# EasyEDA Pro project ProPrj_AI台灯_模块版_2026-09-22.epro, schematic Schematic1, sheets 1 to 4 of 5

## Sheets
1 POWER: Assembly Variant: Basic; Board Name: Board1; Create Date: 2026-09-16; Page Name: P1; Project Name: AI台灯_模块版; Schematic Name: Schematic1; Update Date: 2026-09-16; Company: 嘉立创EDA; Page Size: A4; Version: V1.0
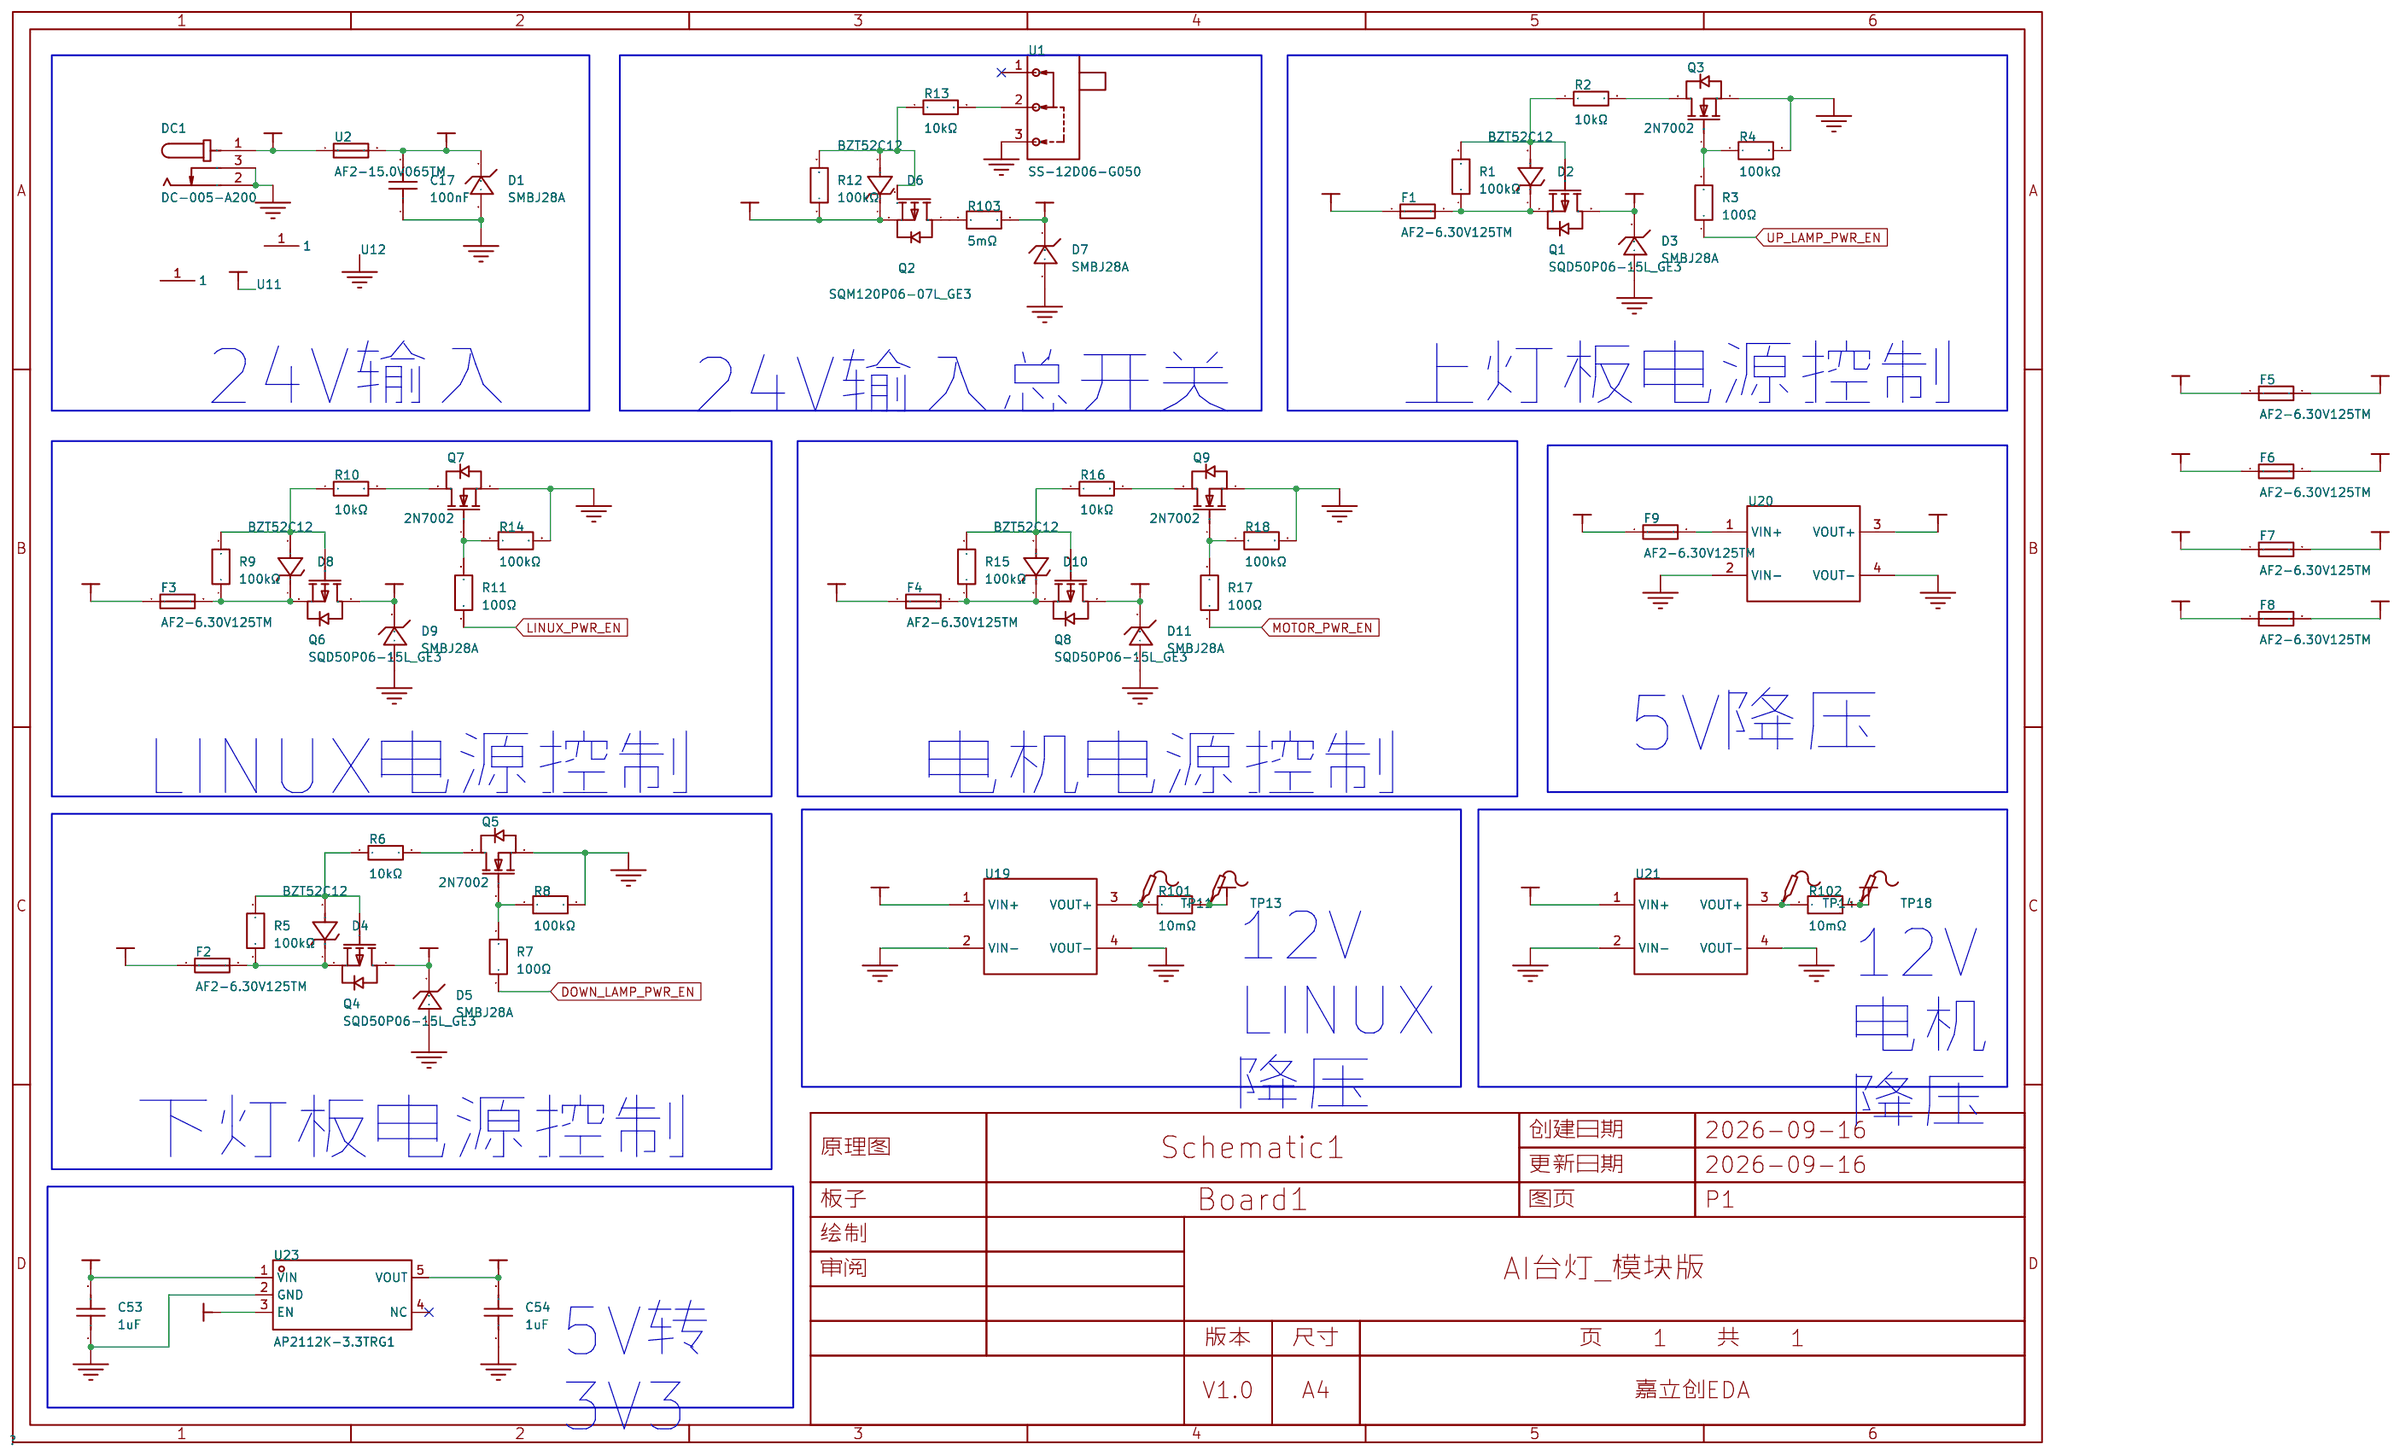
[diagram p0: POWER]
2 MCU_CORE: Page Name: P3
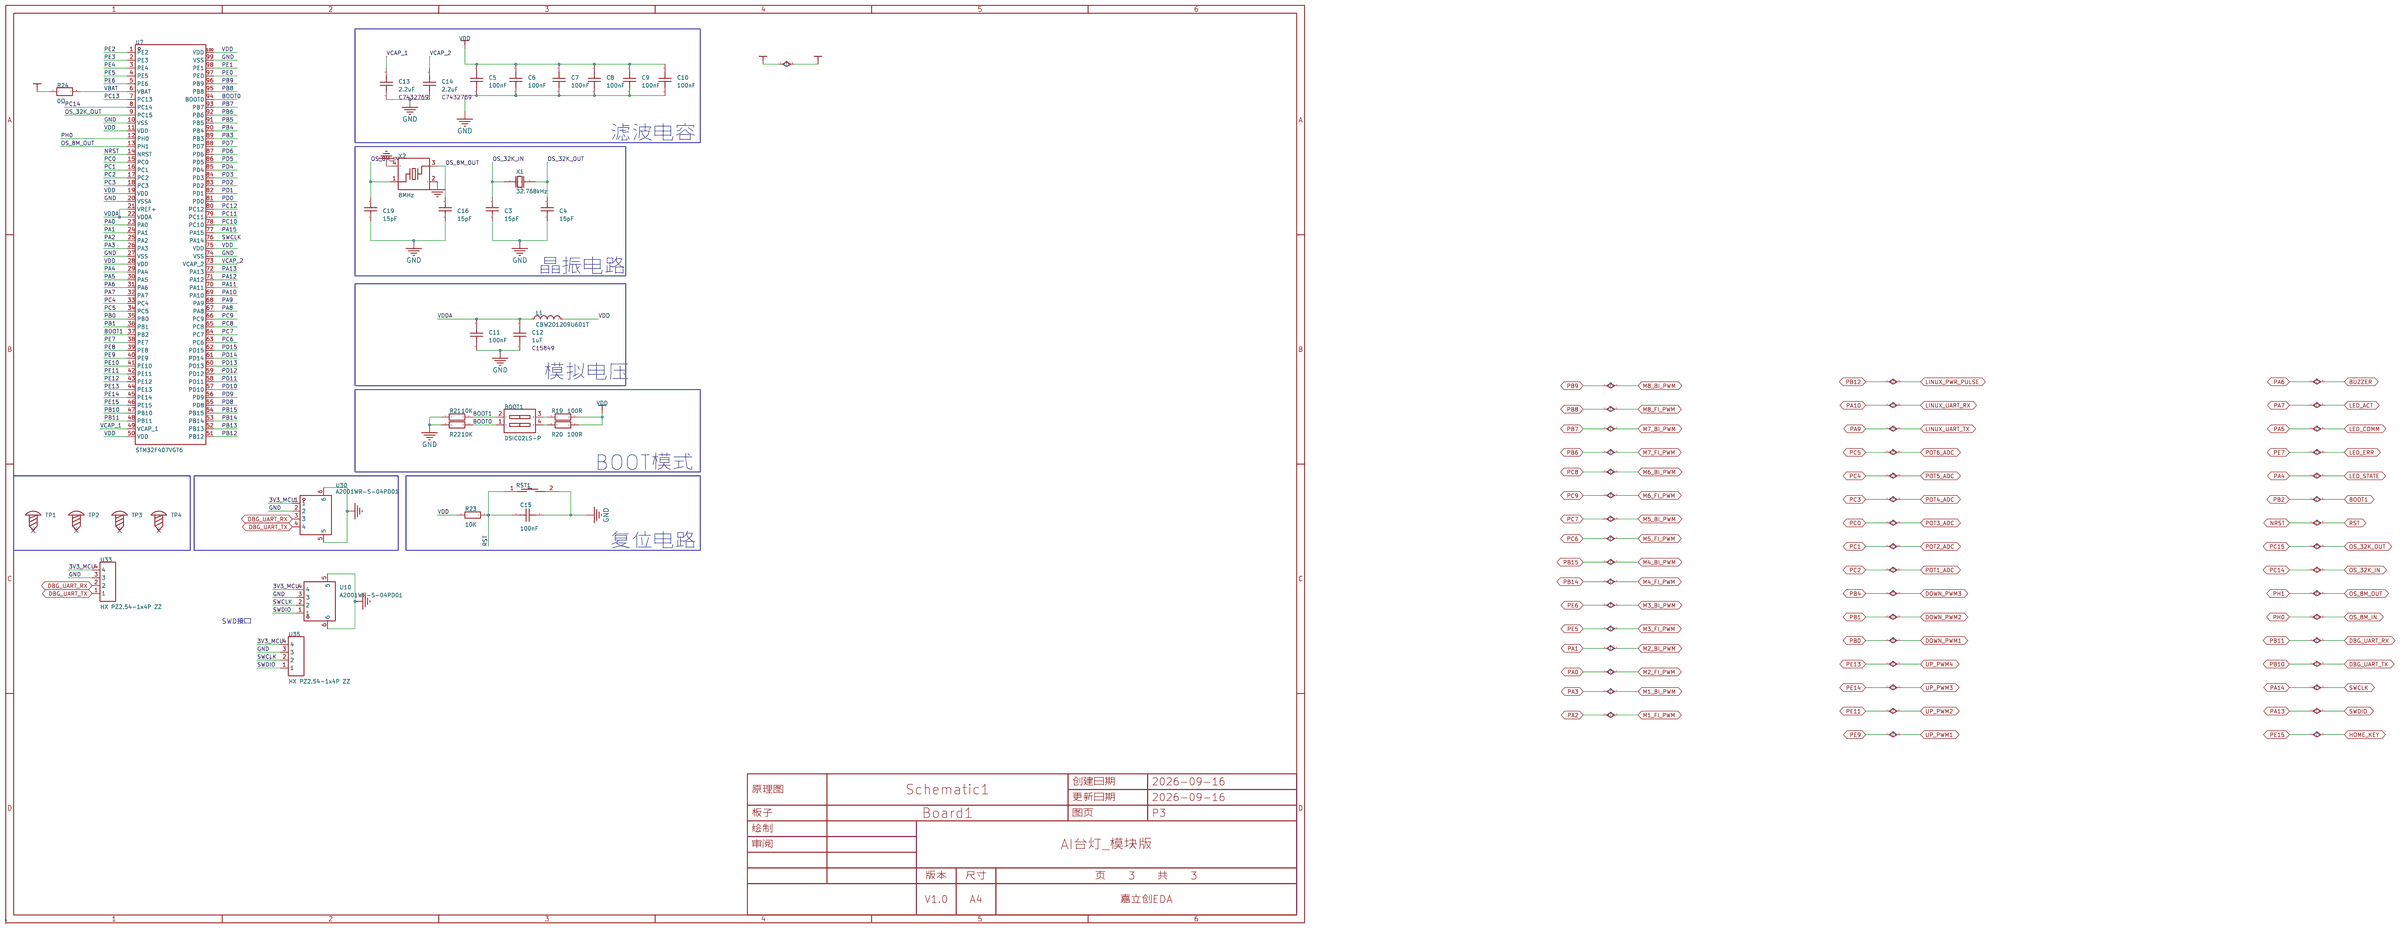
[diagram p1: MCU_CORE]
3 MOTOR_DRIVER: Page Name: P4
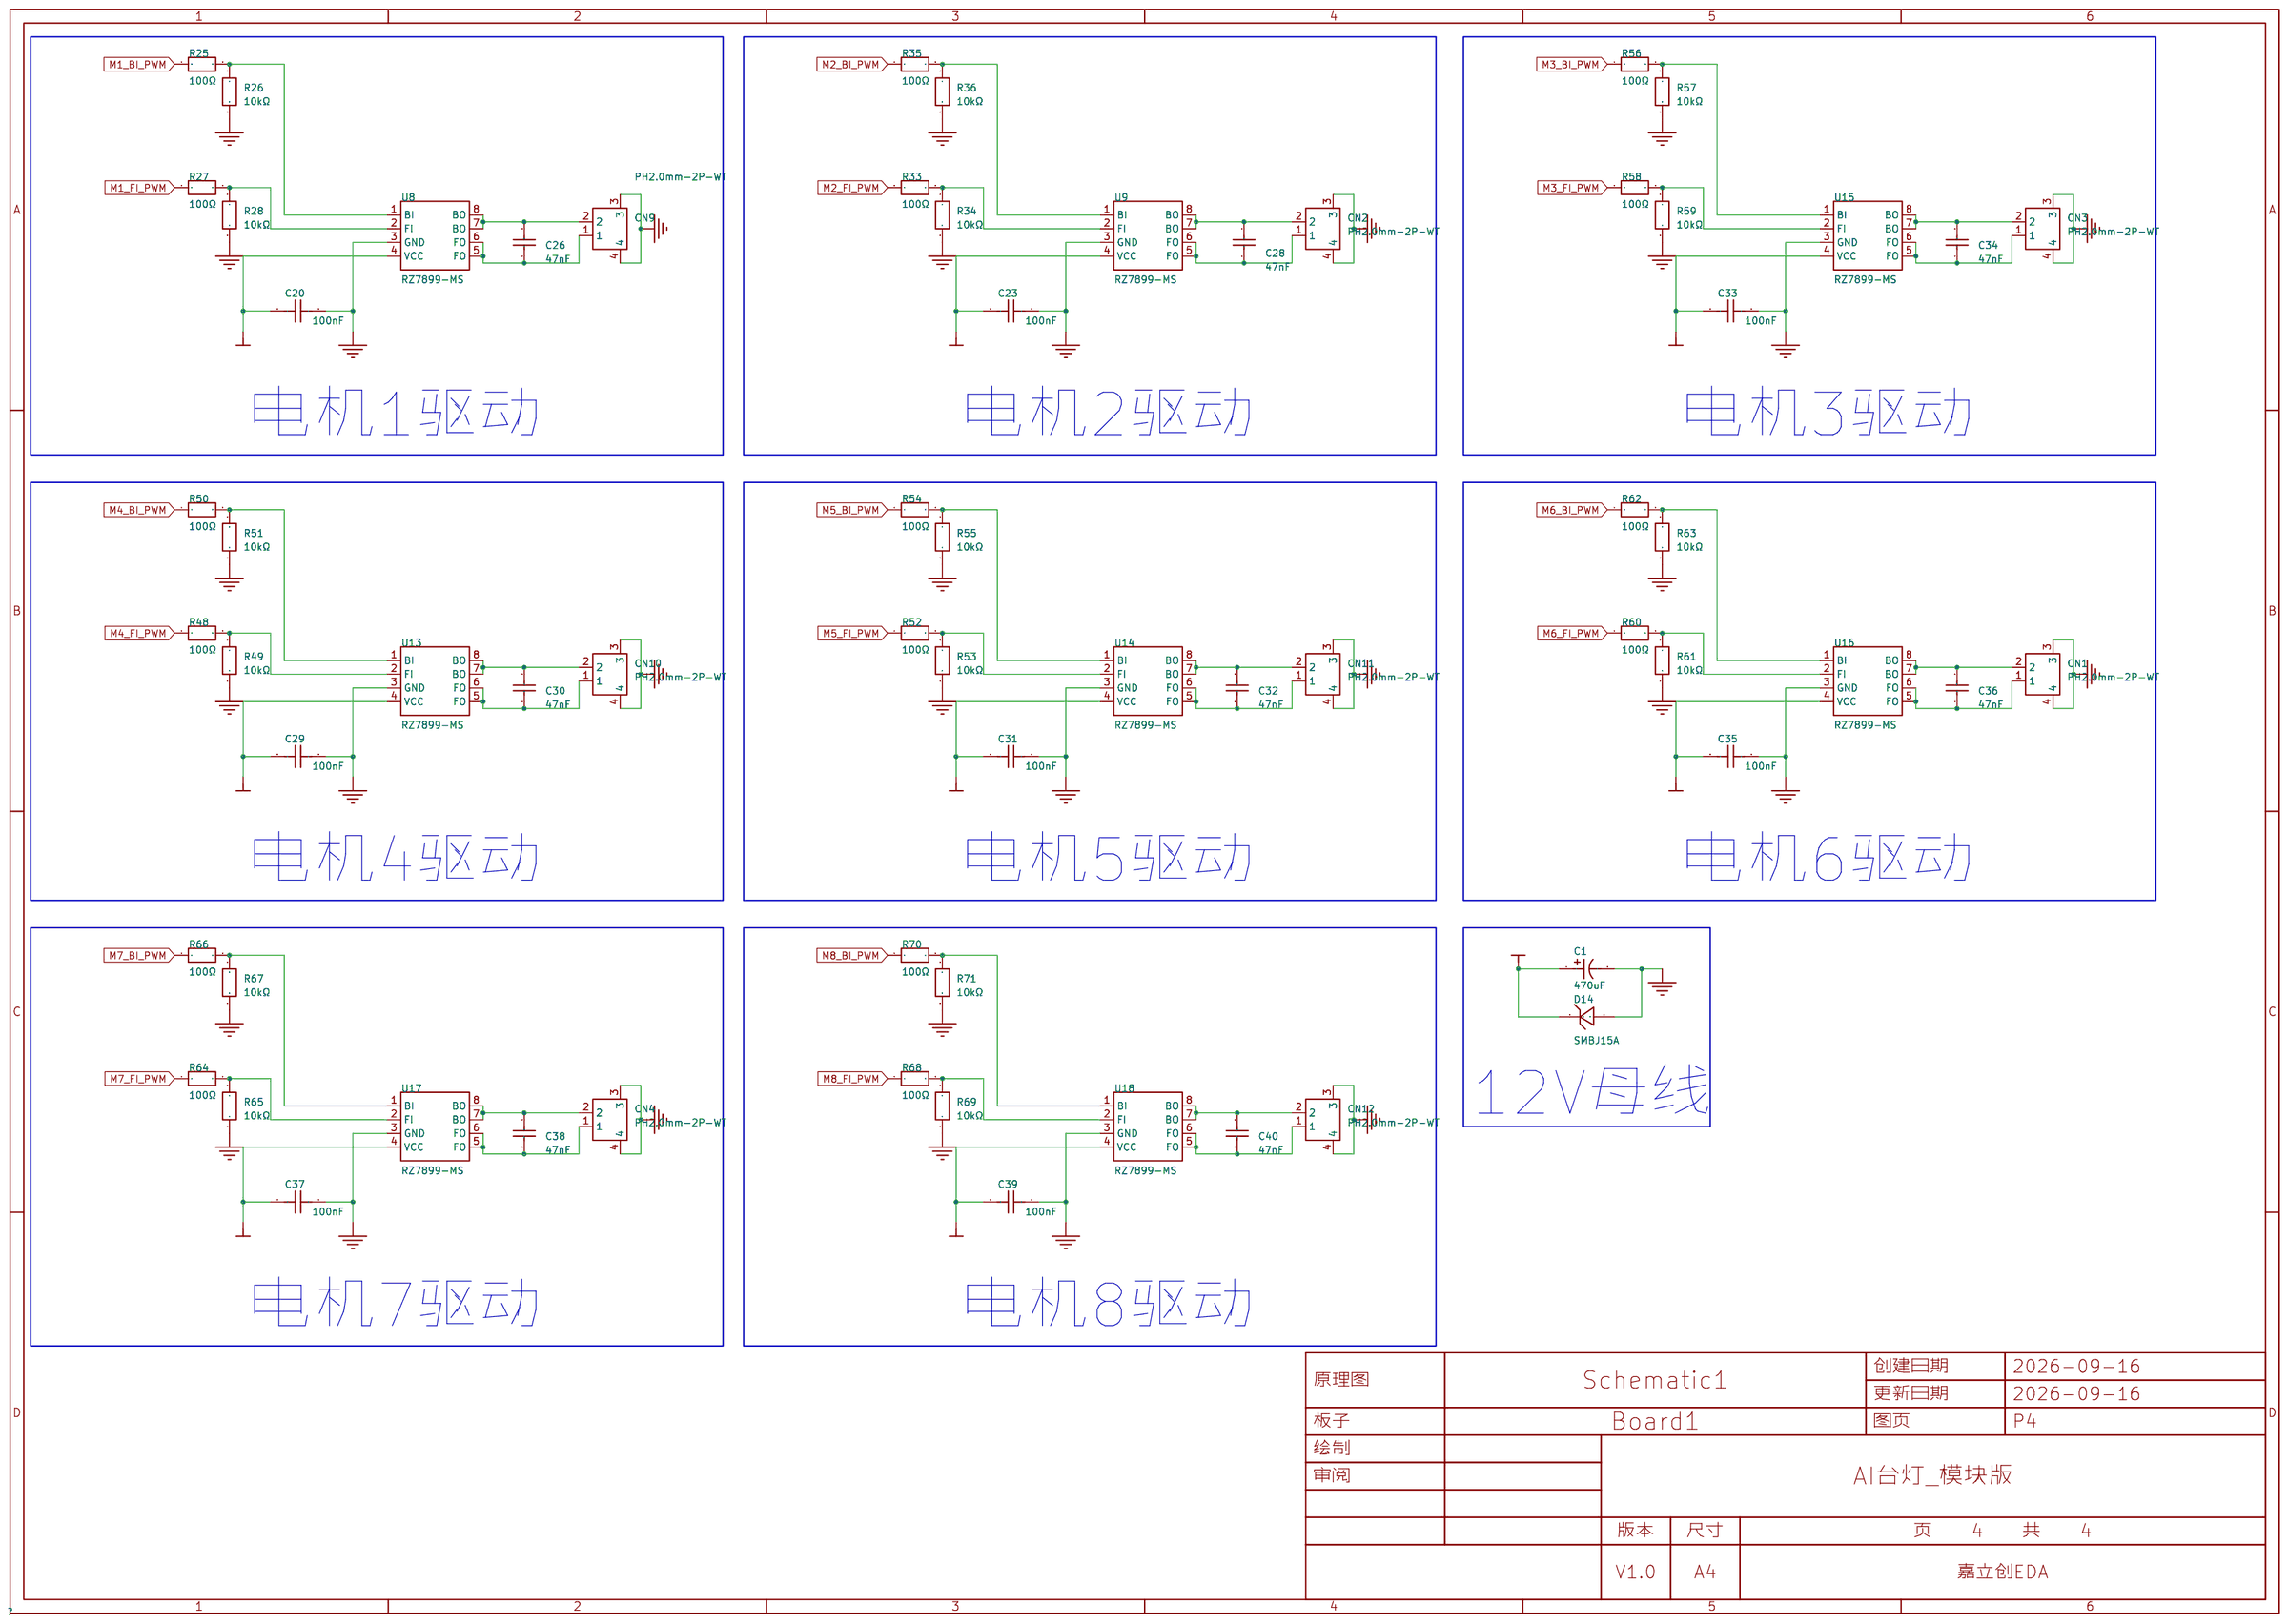
[diagram p2: MOTOR_DRIVER]
4 POT_ADC: Page Name: P5
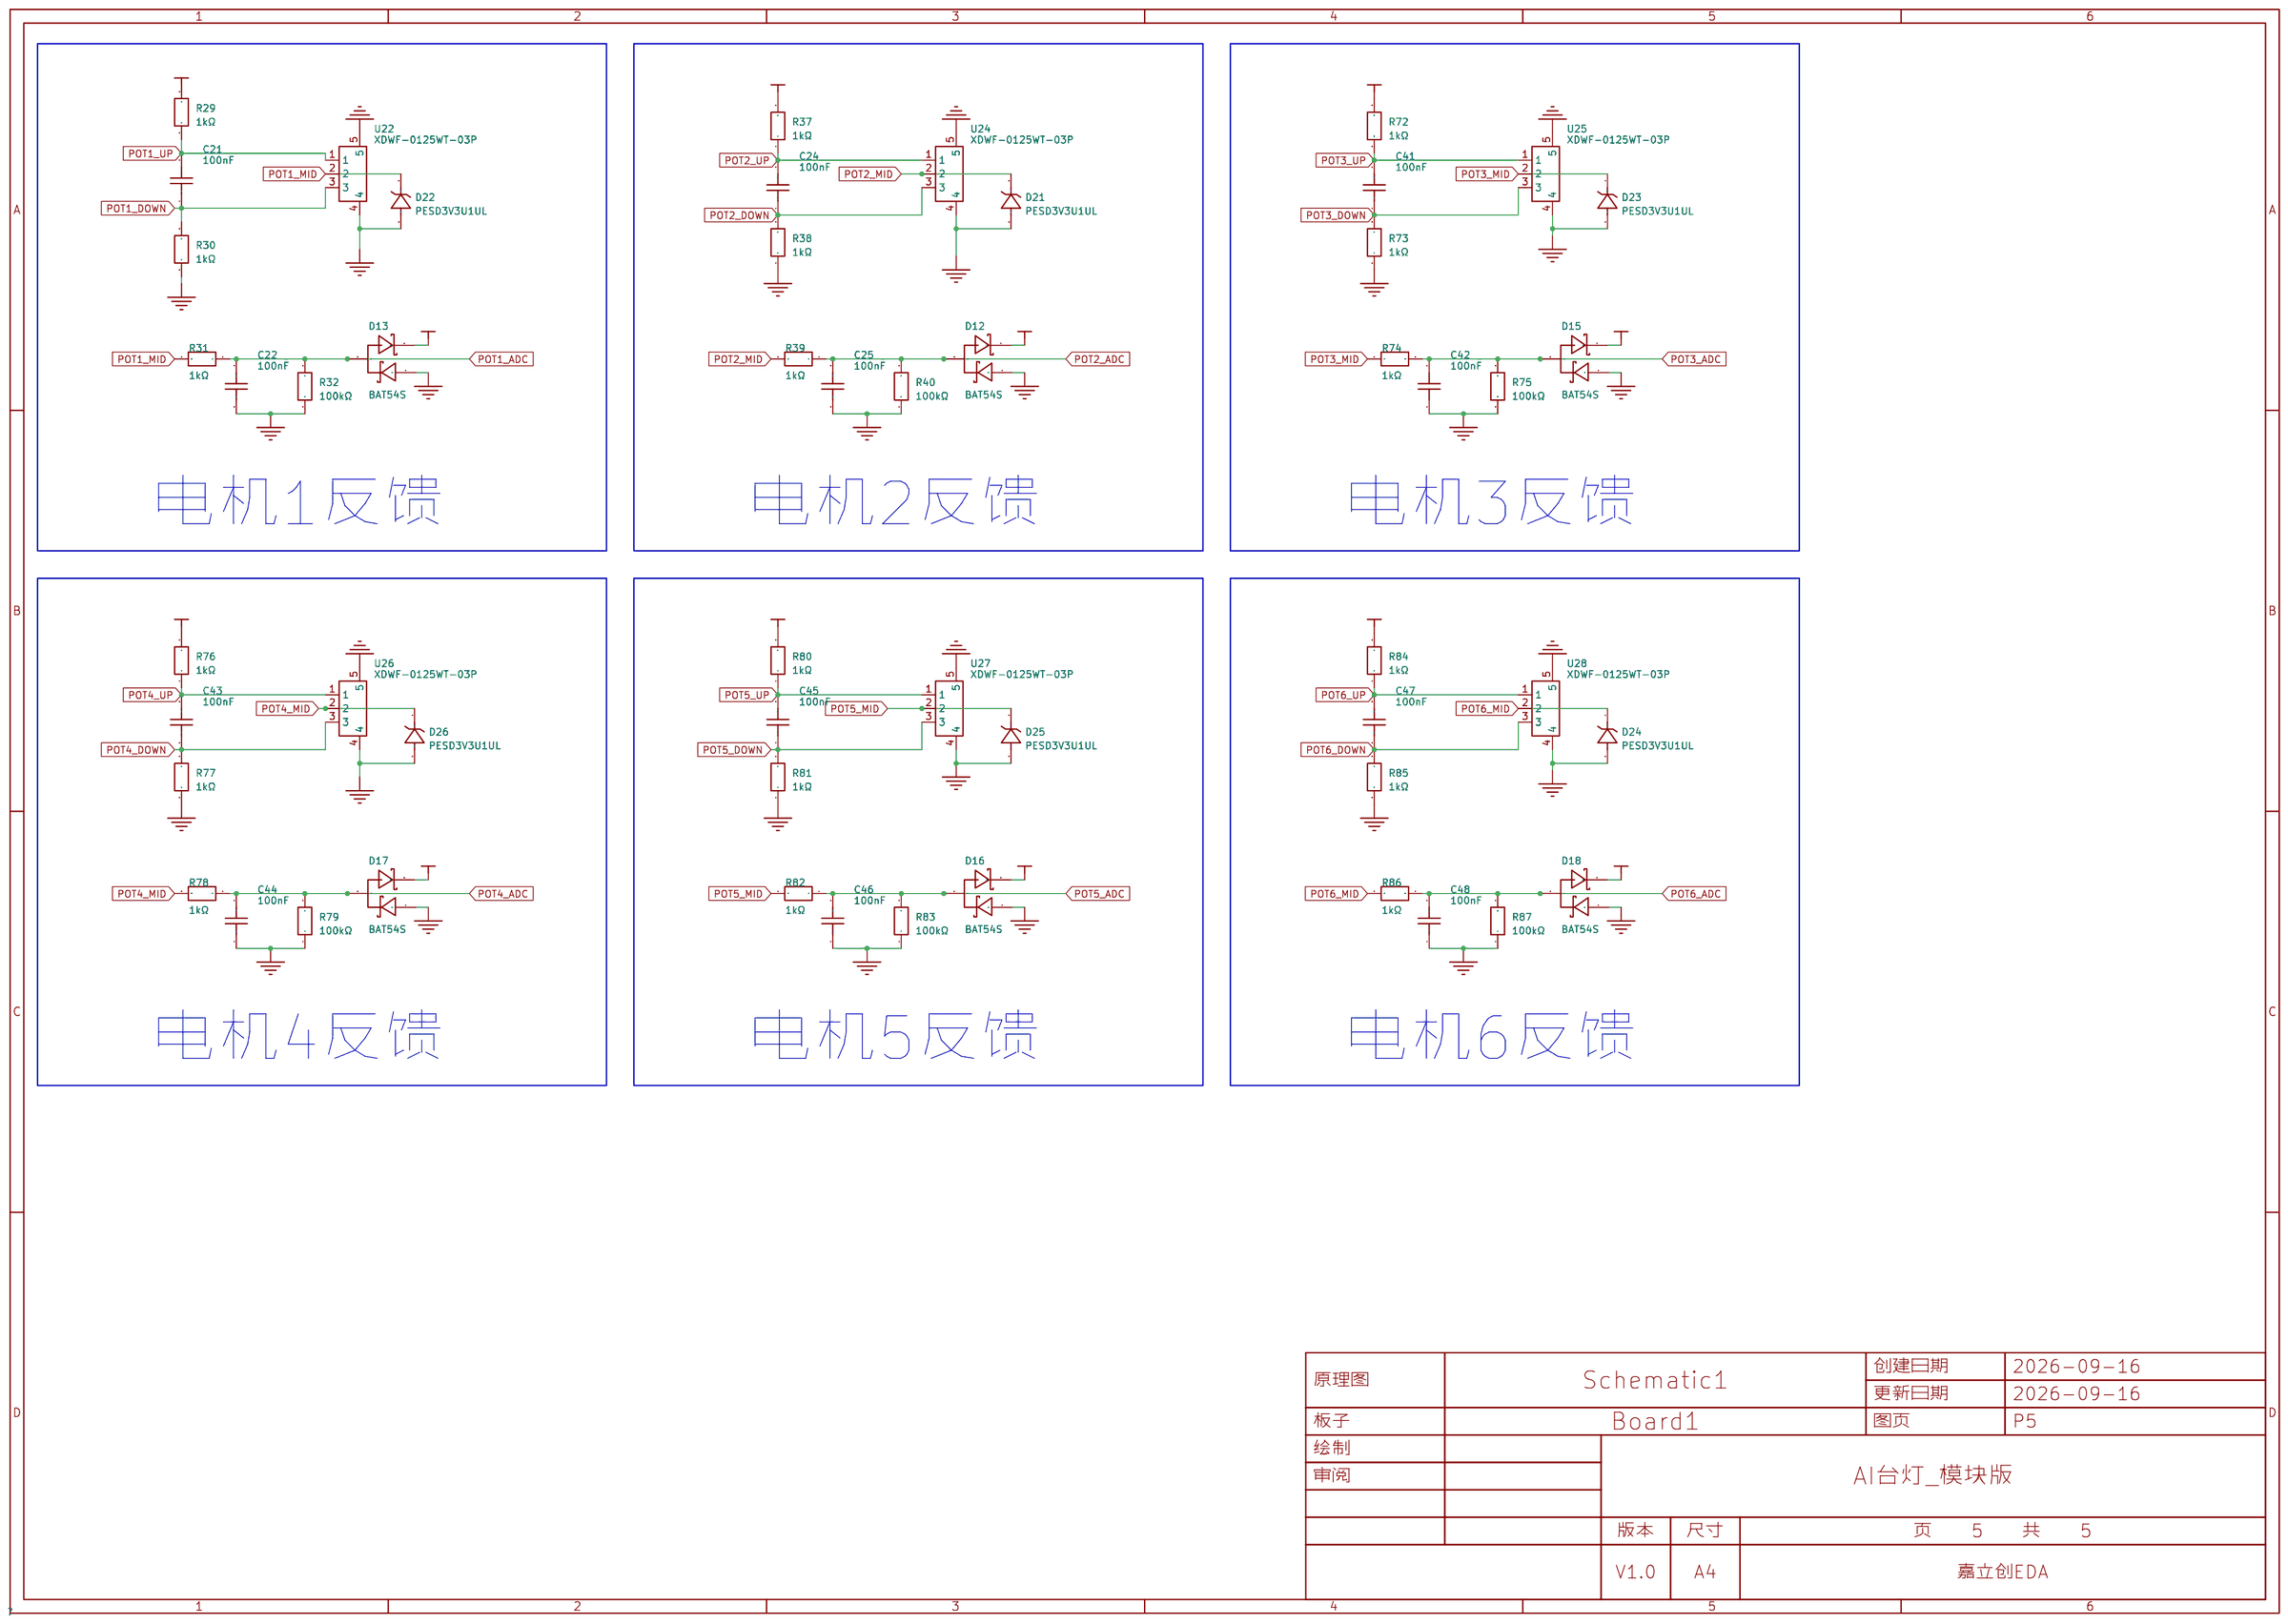
[diagram p3: POT_ADC]

## Parts
sheet MCU_CORE
BOOT1  DSIC02LS-P  [SW-SMD_4P-L5.1-W6.1-P2.54-LS9.8]
C3  15pF  [C0603]
C4  15pF  [C0603]
C5  100nF  [C0603]
C6  100nF  [C0603]
C7  100nF  [C0603]
C8  100nF  [C0603]
C9  100nF  [C0603]
C10  100nF  [C0603]
C11  100nF  [C0603]
C12  1uF  [C0603]
C13  2.2uF  [C0603]
C14  2.2uF  [C0603]
C15  100nF  [C0603]
C16  15pF  [C0603]
C19  15pF  [C0603]
L1  CBW201209U601T  [L0805]
R19  100R  [R0603]
R20  100R  [R0603]
R21  10K  [R0603]
R22  10K  [R0603]
R23  10K  [R0603]
R24  0Ω  [R0603]
RST1  EVQPE104K  [SW-SMD_L6.0-W3.5-LS7.2]
TP1  -  [M3螺丝]
TP2  -  [M3螺丝]
TP3  -  [M3螺丝]
TP4  -  [M3螺丝]
U7  STM32F407VGT6  [LQFP-100_L14.0-W14.0-P0.50-LS16.0-BL]
U10  A2001WR-S-04PD01  [CONN-SMD_A2001WR-S-04PD01]
U30  A2001WR-S-04PD01  [CONN-SMD_A2001WR-S-04PD01]
U33  HX PZ2.54-1x4P ZZ  [HDR-TH_4P-P2.54-V-M]
U35  HX PZ2.54-1x4P ZZ  [HDR-TH_4P-P2.54-V-M]
X1  32.768kHz  [CRYSTAL-SMD_2P-L2.0-W1.2]
X2  8MHz  [CRYSTAL-SMD_4P-L3.2-W2.5-BL]
sheet MOTOR_DRIVER
C1  470uF  [CAP-TH_BD10.0-P5.00-D1.0-FD-H16.0]
C20  100nF  [C0603]
C23  100nF  [C0603]
C26  47nF  [C0603]
C28  47nF  [C0603]
C29  100nF  [C0603]
C30  47nF  [C0603]
C31  100nF  [C0603]
C32  47nF  [C0603]
C33  100nF  [C0603]
C34  47nF  [C0603]
C35  100nF  [C0603]
C36  47nF  [C0603]
C37  100nF  [C0603]
C38  47nF  [C0603]
C39  100nF  [C0603]
C40  47nF  [C0603]
CN1  PH2.0mm-2P-WT  [CONN-SMD_2P-P2.00_PH2.0-2PWT]
CN2  PH2.0mm-2P-WT  [CONN-SMD_2P-P2.00_PH2.0-2PWT]
CN3  PH2.0mm-2P-WT  [CONN-SMD_2P-P2.00_PH2.0-2PWT]
CN4  PH2.0mm-2P-WT  [CONN-SMD_2P-P2.00_PH2.0-2PWT]
CN9  PH2.0mm-2P-WT  [CONN-SMD_2P-P2.00_PH2.0-2PWT]
CN10  PH2.0mm-2P-WT  [CONN-SMD_2P-P2.00_PH2.0-2PWT]
CN11  PH2.0mm-2P-WT  [CONN-SMD_2P-P2.00_PH2.0-2PWT]
CN12  PH2.0mm-2P-WT  [CONN-SMD_2P-P2.00_PH2.0-2PWT]
D14  SMBJ15A  [SMB_L4.6-W3.6-LS5.3-RD]
R25  100Ω  [R0603]
R26  10kΩ  [R0603]
R27  100Ω  [R0603]
R28  10kΩ  [R0603]
R33  100Ω  [R0603]
R34  10kΩ  [R0603]
R35  100Ω  [R0603]
R36  10kΩ  [R0603]
R48  100Ω  [R0603]
R49  10kΩ  [R0603]
R50  100Ω  [R0603]
R51  10kΩ  [R0603]
R52  100Ω  [R0603]
R53  10kΩ  [R0603]
R54  100Ω  [R0603]
R55  10kΩ  [R0603]
R56  100Ω  [R0603]
R57  10kΩ  [R0603]
R58  100Ω  [R0603]
R59  10kΩ  [R0603]
R60  100Ω  [R0603]
R61  10kΩ  [R0603]
R62  100Ω  [R0603]
R63  10kΩ  [R0603]
R64  100Ω  [R0603]
R65  10kΩ  [R0603]
R66  100Ω  [R0603]
R67  10kΩ  [R0603]
R68  100Ω  [R0603]
R69  10kΩ  [R0603]
R70  100Ω  [R0603]
R71  10kΩ  [R0603]
U8  RZ7899-MS  [SOIC-8_L4.9-W3.9-P1.27-LS6.0-BL]
U9  RZ7899-MS  [SOIC-8_L4.9-W3.9-P1.27-LS6.0-BL]
U13  RZ7899-MS  [SOIC-8_L4.9-W3.9-P1.27-LS6.0-BL]
U14  RZ7899-MS  [SOIC-8_L4.9-W3.9-P1.27-LS6.0-BL]
U15  RZ7899-MS  [SOIC-8_L4.9-W3.9-P1.27-LS6.0-BL]
U16  RZ7899-MS  [SOIC-8_L4.9-W3.9-P1.27-LS6.0-BL]
U17  RZ7899-MS  [SOIC-8_L4.9-W3.9-P1.27-LS6.0-BL]
U18  RZ7899-MS  [SOIC-8_L4.9-W3.9-P1.27-LS6.0-BL]
sheet POT_ADC
C21  100nF  [C0603]
C22  100nF  [C0603]
C24  100nF  [C0603]
C25  100nF  [C0603]
C41  100nF  [C0603]
C42  100nF  [C0603]
C43  100nF  [C0603]
C44  100nF  [C0603]
C45  100nF  [C0603]
C46  100nF  [C0603]
C47  100nF  [C0603]
C48  100nF  [C0603]
D12  BAT54S  [SOT-23-3_L2.9-W1.3-P1.90-LS2.4-BR]
D13  BAT54S  [SOT-23-3_L2.9-W1.3-P1.90-LS2.4-BR]
D15  BAT54S  [SOT-23-3_L2.9-W1.3-P1.90-LS2.4-BR]
D16  BAT54S  [SOT-23-3_L2.9-W1.3-P1.90-LS2.4-BR]
D17  BAT54S  [SOT-23-3_L2.9-W1.3-P1.90-LS2.4-BR]
D18  BAT54S  [SOT-23-3_L2.9-W1.3-P1.90-LS2.4-BR]
D21  PESD3V3U1UL  [SOD-882_L1.0-W0.6-RD]
D22  PESD3V3U1UL  [SOD-882_L1.0-W0.6-RD]
D23  PESD3V3U1UL  [SOD-882_L1.0-W0.6-RD]
D24  PESD3V3U1UL  [SOD-882_L1.0-W0.6-RD]
D25  PESD3V3U1UL  [SOD-882_L1.0-W0.6-RD]
D26  PESD3V3U1UL  [SOD-882_L1.0-W0.6-RD]
R29  1kΩ  [R0603]
R30  1kΩ  [R0603]
R31  1kΩ  [R0603]
R32  100kΩ  [R0603]
R37  1kΩ  [R0603]
R38  1kΩ  [R0603]
R39  1kΩ  [R0603]
R40  100kΩ  [R0603]
R72  1kΩ  [R0603]
R73  1kΩ  [R0603]
R74  1kΩ  [R0603]
R75  100kΩ  [R0603]
R76  1kΩ  [R0603]
R77  1kΩ  [R0603]
R78  1kΩ  [R0603]
R79  100kΩ  [R0603]
R80  1kΩ  [R0603]
R81  1kΩ  [R0603]
R82  1kΩ  [R0603]
R83  100kΩ  [R0603]
R84  1kΩ  [R0603]
R85  1kΩ  [R0603]
R86  1kΩ  [R0603]
R87  100kΩ  [R0603]
U22  XDWF-0125WT-03P  [CONN-SMD_3P-P1.25_XDWF-0125WT-03P]
U24  XDWF-0125WT-03P  [CONN-SMD_3P-P1.25_XDWF-0125WT-03P]
U25  XDWF-0125WT-03P  [CONN-SMD_3P-P1.25_XDWF-0125WT-03P]
U26  XDWF-0125WT-03P  [CONN-SMD_3P-P1.25_XDWF-0125WT-03P]
U27  XDWF-0125WT-03P  [CONN-SMD_3P-P1.25_XDWF-0125WT-03P]
U28  XDWF-0125WT-03P  [CONN-SMD_3P-P1.25_XDWF-0125WT-03P]
sheet POWER
C17  100nF  [C0603]
C53  1uF  [C0603]
C54  1uF  [C0603]
D1  SMBJ28A  [SMB_L4.6-W3.6-LS5.3-RD]
D2  BZT52C12  [SOD-123_L2.7-W1.6-LS3.7-RD]
D3  SMBJ28A  [SMB_L4.6-W3.6-LS5.3-RD]
D4  BZT52C12  [SOD-123_L2.7-W1.6-LS3.7-RD]
D5  SMBJ28A  [SMB_L4.6-W3.6-LS5.3-RD]
D6  BZT52C12  [SOD-123_L2.7-W1.6-LS3.7-RD]
D7  SMBJ28A  [SMB_L4.6-W3.6-LS5.3-RD]
D8  BZT52C12  [SOD-123_L2.7-W1.6-LS3.7-RD]
D9  SMBJ28A  [SMB_L4.6-W3.6-LS5.3-RD]
D10  BZT52C12  [SOD-123_L2.7-W1.6-LS3.7-RD]
D11  SMBJ28A  [SMB_L4.6-W3.6-LS5.3-RD]
DC1  DC-005-A200  [DC-IN-TH_DC-005-A200]
F1  AF2-6.30V125TM  [FUSE-SMD_L6.1-W2.5-1]
F2  AF2-6.30V125TM  [FUSE-SMD_L6.1-W2.5-1]
F3  AF2-6.30V125TM  [FUSE-SMD_L6.1-W2.5-1]
F4  AF2-6.30V125TM  [FUSE-SMD_L6.1-W2.5-1]
F5  AF2-6.30V125TM  [FUSE-SMD_L6.1-W2.5-1]
F6  AF2-6.30V125TM  [FUSE-SMD_L6.1-W2.5-1]
F7  AF2-6.30V125TM  [FUSE-SMD_L6.1-W2.5-1]
F8  AF2-6.30V125TM  [FUSE-SMD_L6.1-W2.5-1]
F9  AF2-6.30V125TM  [FUSE-SMD_L6.1-W2.5-1]
Q1  SQD50P06-15L_GE3  [TO-252-2_L6.6-W6.1-P4.58-LS9.9-BR]
Q2  SQM120P06-07L_GE3  [TO-263-2_L10.1-W9.1-P5.08-LS15.2-TL-1]
Q3  2N7002  [SOT-23-3_L2.9-W1.3-P1.90-LS2.4-BR]
Q4  SQD50P06-15L_GE3  [TO-252-2_L6.6-W6.1-P4.58-LS9.9-BR]
Q5  2N7002  [SOT-23-3_L2.9-W1.3-P1.90-LS2.4-BR]
Q6  SQD50P06-15L_GE3  [TO-252-2_L6.6-W6.1-P4.58-LS9.9-BR]
Q7  2N7002  [SOT-23-3_L2.9-W1.3-P1.90-LS2.4-BR]
Q8  SQD50P06-15L_GE3  [TO-252-2_L6.6-W6.1-P4.58-LS9.9-BR]
Q9  2N7002  [SOT-23-3_L2.9-W1.3-P1.90-LS2.4-BR]
R1  100kΩ  [R0603]
R2  10kΩ  [R0603]
R3  100Ω  [R0603]
R4  100kΩ  [R0603]
R5  100kΩ  [R0603]
R6  10kΩ  [R0603]
R7  100Ω  [R0603]
R8  100kΩ  [R0603]
R9  100kΩ  [R0603]
R10  10kΩ  [R0603]
R11  100Ω  [R0603]
R12  100kΩ  [R0603]
R13  10kΩ  [R0603]
R14  100kΩ  [R0603]
R15  100kΩ  [R0603]
R16  10kΩ  [R0603]
R17  100Ω  [R0603]
R18  100kΩ  [R0603]
R101  10mΩ  [R2512]
R102  10mΩ  [R2512]
R103  5mΩ  [R2512]
TP11  -  [Test-Point-0.5mm]
TP13  -  [Test-Point-0.5mm]
TP14  -  [Test-Point-0.5mm]
TP18  -  [Test-Point-0.5mm]
U1  SS-12D06-G050  [SW-TH_3P-P4.70_SS-12D06-G050]
U2  AF2-15.0V065TM  [F2410]
U11  -  [电源焊盘封装]
U12  -  [电源焊盘封装]
U19  -  [24V降压模块封装]
U20  -  [24V降压模块封装]
U21  -  [大功率24V降压模块封装]
U23  AP2112K-3.3TRG1  [SOT-25-5_L2.9-W1.6-P0.95-LS2.8-BL]

## Library data of the parts
BOOT1 = DSIC02LS-P_C489174: 类型:平拨,凸起式;电路结构:单刀单掷;开关位数:2位;额定电流:25mA;额定电压:24V;工作寿命:3千次;颜色:黑色;; LCSC Part Name: 间距2.54mm 平拨,凸起式 2位拨码开关; Supplier Part: C489174; Manufacturer: XKB Connection(中国星坤); Supplier Footprint: SMD-4P,6.1x5.1mm; JLCPCB Part Class: Extended Part; Datasheet: https://item.szlcsc.com/datasheet/DSIC02LS-P/499113.html; Supplier: LCSC; Type: 平拨,凸起式; Current Rating: 25mA; Voltage Rating: 24V; Circuit: 单刀单掷; Number of Positions: 2位; Pin Style: 鸥翼型; Lead Pitch: 2.54mm; Operating Temperature: -20℃~+70℃; Operating Life: 3千次; Color: 黑色; Termination Style: 鸥翼型
C3 C4 C16 C19 = CC0603JRNPO9BN150: 容值:15pF;精度:±5%;额定电压:50V;温度系数:NP0;; LCSC Part Name: 15pF ±5% 50V; Supplier Part: C107037; Manufacturer: YAGEO(国巨); Supplier Footprint: 0603; JLCPCB Part Class: Extended Part; Datasheet: https://item.szlcsc.com/datasheet/CC0603JRNPO9BN150/108253.html; Supplier: LCSC; Tolerance: ±5%; Voltage Rating: 50V; Temperature Coefficient: NP0
C5-C11 C15 = CAP_0603: Supplier Footprint: 0603
C12 = CL10A105KB8NNNC: 容值:1uF;精度:±10%;额定电压:50V;温度系数:X5R;; LCSC Part Name: 1uF ±10% 50V; Supplier Part: C15849; Manufacturer: SAMSUNG(三星); Supplier Footprint: 0603; JLCPCB Part Class: Basic Part; Datasheet: https://item.szlcsc.com/datasheet/CL10A105KB8NNNC/16531.html; Supplier: LCSC; Tolerance: ±10%; Voltage Rating: 50V; Temperature Coefficient: X5R
C13 C14 = HGC0603R5225K500NTHJ: 容值:2.2uF;精度:±10%;额定电压:50V;温度系数:X5R;; LCSC Part Name: 2.2uF ±10% 50V; Supplier Part: C7432769; Manufacturer: Chinocera(华瓷); Supplier Footprint: 0603; JLCPCB Part Class: Extended Part; Datasheet: https://item.szlcsc.com/datasheet/HGC0603R5225K500NTHJ/8438251.html; Supplier: LCSC; Tolerance: ±10%; Voltage Rating: 50V; Temperature Coefficient: X5R
L1 = CBW201209U601T: 阻抗@频率:600Ω@100MHz;误差:±25%;直流电阻(DCR):220mΩ;; LCSC Part Name: 单路 0805磁珠 阻抗600Ω@100MHz; Supplier Part: C21286; Manufacturer: FH(风华); Supplier Footprint: 0805; JLCPCB Part Class: Extended Part; Datasheet: https://item.szlcsc.com/datasheet/CBW201209U601T/22003.html; Supplier: LCSC; Impedance @ Frequency: 600Ω@100MHz; Tolerance: ±25%; DC Resistance: 250mΩ; Current Rating: 1.5A; Circuits: 1; DC Resistance(DCR): 220mΩ; Number of Circuits: 1; Operating Temperature: -55℃~+125℃
R19-R23 = Res_0603: Supplier Footprint: 0603
R24 = FRC0603F0000TS: 电阻类型:厚膜电阻;阻值:0Ω;精度:±1%;功率:100mW;工作电压:75V;; LCSC Part Name: 0Ω ±1% 100mW 厚膜电阻; Supplier Part: C2906974; Manufacturer: FOJAN(富捷); Supplier Footprint: 0603; JLCPCB Part Class: Extended Part; Supplier: LCSC; Type: 厚膜电阻; Tolerance: ±1%; Power(Watts): 100mW; Voltage-Supply(Max): 75V; Operating Temperature: -55℃~+155℃
RST1 = EVQPE104K: 触点电流:50mA;额定电压(AC):-;额定电压(DC):12V;额定功率:-;绝缘电阻:100MΩ;电路结构:单刀单掷;安装方式:立贴;带灯:-;作用力:1N;机械寿命:5万次;带支架:否;; LCSC Part Name: 6*3.5*4.3mm 立贴 轻触开关; Supplier Part: C2915176; Manufacturer: PANASONIC(松下); Supplier Footprint: SMD,3.5x6mm; JLCPCB Part Class: Extended Part; Datasheet: https://atta.szlcsc.com/upload/public/pdf/source/20211105/60475C6014EC98F0797D41637F119F14.pdf; Supplier: LCSC; Contact Current: 50mA; Voltage Rating (DC): 12V; Insulation Resistance: 100MΩ; Circuit: 单刀单掷; Mounting Style: 立贴; Actuator Style: 矩形按钮; Actuator/Cap Color: 白色; Operating Force: 1N; Mechanical Life: 5万次; Operating Temperature: -30℃~+85℃; Pin Style: J型引脚; Switch Length: 6mm; Switch Width: 3.5mm; Switch Height: 4.3mm; Strike Gundam: 否
TP1-TP4 = M3螺丝: Supplier Footprint: 插件
U7 = STM32F407VGT6: CPU内核:ARM Cortex-M4;CPU最大主频:168MHz;程序存储容量:1MB;程序存储器类型:FLASH;RAM总容量:192KB;GPIO端口数量:82;; LCSC Part Name: ARM Cortex-M4 168MHz; Supplier Part: C12345; Manufacturer: ST(意法半导体); Supplier Footprint: LQFP-100(14x14); JLCPCB Part Class: Extended Part; Datasheet: https://atta.szlcsc.com/upload/public/pdf/source/20140724/1457707157848.pdf; Supplier: LCSC; CPU Core: ARM Cortex-M4; CPU Maximum Speed: 168MHz; Operating Voltage Range: 1.8V~3.6V; Program Storage Size: 1MB; Program Memory Type: FLASH; RAM Size: 192KB; GPIO Ports Number: 82; ADC (Bit): 12bit; DAC (Bit): 12bit; Universal Serial Bus: 有; Peripheral/Function: DMA；LCD/LED驱动; Watchdog: 有; Infrared Data Association: 有; Low-Voltage Detect: 有; LCD Module: 有; Direct Memory Access: 有; Internal Oscillator: 有; Operating Temperature Range: -40℃~+85℃
U10 U30 = A2001WR-S-04PD01: 插针结构:1x4P;间距:2mm;安装方式:卧贴;参考系列:PH;总PIN数:4P;排数:1;每排PIN数:4;行距:-;额定电流:2A;触头材质:黄铜;触头镀层:金;工作温度:-25℃~+85℃;; LCSC Part Name: 1x4P 间距:2mm 卧贴 系列:PH; Supplier Part: C278791; Manufacturer: HR(灿达); Supplier Footprint: SMD,P=2mm; JLCPCB Part Class: Extended Part; Datasheet: https://item.szlcsc.com/datasheet/A2001WR-S-04PD01/265939.html; Supplier: LCSC; Pins Structure: 1x4P; Pitch: 2mm; Mounting Type: 卧贴; Reference Series: PH; Number of Pins: 4P; Number of Rows: 1; Number of PINs Per Row: 4; Current Rating: 2A; Contact Material: 黄铜; Contact Plating: 金; Operating Temperature: -25℃~+85℃; Voltage Rating: 100V; Plastic Material: PA6T; Flame Retardant Rating: UL94V-0; Color: 米色; Z-Height of the Board: 5.5mm; Y-Width of Bottom Edge on Board: 7.65mm
U33 U35 = HX PZ2.54-1x4P ZZ: 插针结构:1x4P;间距:2.54mm;行距:-;圆针/方针:方针;安装方式:直插;排数:单排;总PIN位数:4P;额定电流:3A;额定电压:1kV;配合针长度:6mm;塑高:2.5mm;端接针长度:3mm;触头材质:黄铜;触头镀层:金;工作温度:-40℃~+105℃;颜色:黑色;; LCSC Part Name: 1x4P 间距:2.54mm 方针 直插; Supplier Part: C32713270; Manufacturer: hanxia(韩下); Supplier Footprint: 插件,P=2.54mm; JLCPCB Part Class: Extended Part; Datasheet: https://item.szlcsc.com/datasheet/HX%2520PZ2.54-1x4P%2520ZZ/34444550.html; Supplier: LCSC; Pin Structure: 1x4P; Pitch: 2.54mm; Circluar Pins/Square Pins: 方针; Mounting Type: 直插; Number of Rows: 单排; Number of Pins: 4P; Current Rating: 3A; Voltage Rating (Max): 1kV; Length of Mating Pin: 6mm; Insulation Height: 2.5mm; Length of End Connection Pin: 3mm; Contact Material: 黄铜; Contact Plating: 金; Operating Temperature: -40℃~+105℃; Color: 黑色
X1 = XKHEL89CGI-112YLC-32.768K: 晶振类型:贴片晶振;频率:32.768kHz;常温频差:±20ppm;负载电容:12.5pF;频率稳定度:-;; LCSC Part Name: YSX2012SK 32.768KHZ 2P 2012 12.5PF ±20PPM -40~85℃; Supplier Part: C7500573; Manufacturer: YXC(扬兴晶振); Supplier Footprint: SMD2012-2P; JLCPCB Part Class: Extended Part; Datasheet: https://item.szlcsc.com/datasheet/XKHEL89CGI-112YLC-32.768K/8579117.html; Supplier: LCSC; Type: 贴片晶振; Normal temperature Frequency Tolerance: ±20ppm; Load Capacitance: 12.5pF; Equivalent Series Resistance(ESR): 100kΩ; Operating Temperature: -40℃~+85℃
X2 = XL2OI-111-8M: 晶振类型:贴片晶振;频率:8MHz;常温频差:±10ppm;负载电容:12pF;频率稳定度:±20ppm;; LCSC Part Name: YSX321SL 8MHZ 4P 3225 12PF ±10PPM -40~85℃ (±20PPM); Supplier Part: C20617566; Manufacturer: YXC(扬兴晶振); Supplier Footprint: SMD3225-4P; JLCPCB Part Class: Extended Part; Datasheet: https://item.szlcsc.com/datasheet/XL2OI-111-8M/21991568.html; Supplier: LCSC; Type: 贴片晶振; Normal temperature Frequency Tolerance: ±10ppm; Load Capacitance: 12pF; Frequency Stability: ±20ppm; Equivalent Series Resistance(ESR): 180Ω; Operating Temperature: -40℃~+85℃
C1 = UHD1E471MPD6TD: 容值:470uF;精度:±20%;额定电压:25V;纹波电流:95mA@100kHz;等效串联电阻(ESR):-;; LCSC Part Name: 470uF ±20% 25V; Supplier Part: C2165454; Manufacturer: Nichicon(尼吉康); Supplier Footprint: 插件; JLCPCB Part Class: Extended Part; Datasheet: https://item.szlcsc.com/datasheet/UHD1E471MPD6TD/2257506.html; Supplier: LCSC; Tolerance: ±20%; Voltage Rating: 25V; Ripple Current: 95mA@100kHz; Pin Spacing: 5mm; Diameter: 10mm; Lifetime: 4000hrs@105℃; Operating Temperature: -40℃~+105℃; Polarity type: 有极性
C20-C25 C29 C31 C33 C35 C37 C39 C41-C48 = CC0603KRX7R0BB104: 容值:100nF;精度:±10%;额定电压:100V;温度系数:X7R;; LCSC Part Name: 100nF ±10% 100V; Supplier Part: C113803; Manufacturer: YAGEO(国巨); Supplier Footprint: 0603; JLCPCB Part Class: Extended Part; Datasheet: https://item.szlcsc.com/datasheet/CC0603KRX7R0BB104/115039.html; Supplier: LCSC; Tolerance: ±10%; Voltage Rating: 100V; Temperature Coefficient: X7R
C26 C28 C30 C32 C34 C36 C38 C40 = CL10B473KB8NNNC: 容值:47nF;精度:±10%;额定电压:50V;温度系数:X7R;; LCSC Part Name: 47nF ±10% 50V; Supplier Part: C1622; Manufacturer: SAMSUNG(三星); Supplier Footprint: 0603; JLCPCB Part Class: Basic Part; Datasheet: https://item.szlcsc.com/datasheet/CL10B473KB8NNNC/1974.html; Supplier: LCSC; Tolerance: ±10%; Voltage Rating: 50V; Temperature Coefficient: X7R
CN1-CN4 CN9-CN12 = PH2.0mm-2P-WT: 插针结构:1x2P;间距:2mm;安装方式:卧贴;参考系列:PH;总PIN数:2P;排数:1;每排PIN数:2;额定电流:2A;触头材质:黄铜;触头镀层:锡;工作温度:-25℃~+85℃;; LCSC Part Name: 1x2P 间距:2mm 卧贴 系列:PH; Supplier Part: C53055418; Manufacturer: LXWCONN(连兴旺电子); Supplier Footprint: SMD,P=2mm,卧贴; JLCPCB Part Class: Extended Part; Datasheet: https://item.szlcsc.com/datasheet/PH2.0mm-2P-WT/55999618.html; Supplier: LCSC; Pins Structure: 1x2P; Pitch: 2mm; Mounting Type: 卧贴; Reference Series: PH; Number of Pins: 2P; Number of Rows: 1; Number of PINs Per Row: 2; Current Rating: 2A; Contact Material: 黄铜; Contact Plating: 锡; Operating Temperature: -25℃~+85℃; Voltage Rating: 250V; Plastic Material: LCP
D14 = SMBJ15A_C83846: 极性:单向;反向截止电压(Vrwm):15V;钳位电压:24.4V;峰值脉冲电流(Ipp):24.6A;峰值脉冲功率(Ppp):600W@10/1000us;击穿电压(VBR):16.7V;; LCSC Part Name: 单向TVS 15V截止 峰值浪涌电流：24.6A; Supplier Part: C83846; Manufacturer: Littelfuse(美国力特); Supplier Footprint: DO-214AA; JLCPCB Part Class: Extended Part; Datasheet: https://item.szlcsc.com/datasheet/SMBJ15A/85013.html; Supplier: LCSC; Polarity: 单向; Reverse Stand-Off Voltage (Vrwm): 15V; Clamping Voltage: 24.4V; Peak Pulse Current (Ipp): 24.6A; Peak Pulse Power Dissipation (Ppp): 600W@10/1000us; Voltage - Breakdown: 16.7V; Reverse Leakage Current (Ir): 1uA; Number of Channels: 单路; Operating Temperature: -65℃~+150℃; level of protection: IEC 61000-4-4；IEC 61000-4-2; Type: TVS
R3 R7 R11 R17 R25 R27 R33 R35 R48 R50 R52 R54 R56 R58 R60 R62 R64 R66 R68 R70 = FRC0603F1000TS: 电阻类型:厚膜电阻;阻值:100Ω;精度:±1%;功率:100mW;工作电压:75V;温度系数:±100ppm/℃;; LCSC Part Name: 100Ω ±1% 100mW 厚膜电阻; Supplier Part: C2906981; Manufacturer: FOJAN(富捷); Supplier Footprint: 0603; JLCPCB Part Class: Extended Part; Datasheet: https://item.szlcsc.com/datasheet/FRC0603F1000TS/3180494.html; Supplier: LCSC; Type: 厚膜电阻; Tolerance: ±1%; Power(Watts): 100mW; Voltage-Supply(Max): 75V; Temperature Coefficient: ±100ppm/℃; Operating Temperature: -55℃~+155℃
R26 R28 R34 R36 R49 R51 R53 R55 R57 R59 R61 R63 R65 R67 R69 R71 = FRC0603J103 TS: 电阻类型:厚膜电阻;阻值:10kΩ;精度:±5%;功率:100mW;工作电压:75V;温度系数:±100ppm/℃;; LCSC Part Name: 10kΩ ±5% 100mW 厚膜电阻; Supplier Part: C2930027; Manufacturer: FOJAN(富捷); Supplier Footprint: 0603; JLCPCB Part Class: Extended Part; Datasheet: https://item.szlcsc.com/datasheet/FRC0603J103%2520TS/3266960.html; Supplier: LCSC; Type: 厚膜电阻; Tolerance: ±5%; Power(Watts): 100mW; Voltage-Supply(Max): 75V; Temperature Coefficient: ±100ppm/℃; Operating Temperature: -55℃~+155℃
U8 U9 U13-U18 = RZ7899-MS: DC双向马达驱动芯片，采用SOP8封装，具备最大输出电流6A,工作电压3.0-30V,超低导通电阻，静态电流1UA,具有过热保护，短路保护，过流保护及紧急停止功能等。因其卓越的性能，被广泛应用于机器人、无人机、智能家居设备、电动工具、个人移动设备、玩具及各种自动化控制系统中的直流电机驱动。; LCSC Part Name: DC双向马达驱动电路; Supplier Part: C22462553; Manufacturer: MSKSEMI(美森科); Supplier Footprint: SOP-8; JLCPCB Part Class: Extended Part; Datasheet: https://item.szlcsc.com/datasheet/RZ7899-MS/24148603.html; Supplier: LCSC; Technology: 是; Number of H-bridges: 1; Output Current: 6A; Voltage - Supply: 3V~30V; RDS(on): 80mΩ; Quiescent Current(Iq): 1mA; Operating Temperature: -25℃~+85℃; Features: 主动制动功能；电流采样/调节功能
D12 D13 D15-D18 = BAT54S_C7420333: 二极管配置:1对串联式;正向压降(Vf):400mV@10mA;直流反向耐压(Vr):30V;整流电流:200mA;; LCSC Part Name: 电压:30V 电流:200mA; Supplier Part: C7420333; Manufacturer: R+O(宏嘉诚); Supplier Footprint: SOT-23; JLCPCB Part Class: Extended Part; Datasheet: https://item.szlcsc.com/datasheet/BAT54S/8397155.html; Supplier: LCSC; Diode Configuration: 1对串联式; Voltage - Forward(Vf@If): 400mV@10mA; Voltage - DC Reverse(Vr): 30V; Current - Rectified: 200mA; Reverse Leakage Current (Ir): 2uA@30V; Non-Repetitive Peak Forward Surge Current: 600mA
D21-D26 = PESD3V3U1UL: 极性:单向;反向截止电压(Vrwm):3.3V;钳位电压:15V;峰值脉冲电流(Ipp):4A@8/20us;峰值脉冲功率(Ppp):60W@8/20us;击穿电压(VBR):4.2V;; LCSC Part Name: 单向TVS 3.3V截止 峰值浪涌电流：4A@8/20us; Supplier Part: C19829543; Manufacturer: TECH PUBLIC(台舟); Supplier Footprint: DFN1006-2; JLCPCB Part Class: Extended Part; Datasheet: https://item.szlcsc.com/datasheet/PESD3V3U1UL/21156838.html; Supplier: LCSC; Polarity: 单向; Reverse Stand-Off Voltage (Vrwm): 3.3V; Clamping Voltage: 15V; Peak Pulse Current (Ipp): 4A@8/20us; Peak Pulse Power Dissipation (Ppp): 60W@8/20us; Voltage - Breakdown: 4.2V; Reverse Leakage Current (Ir): 80nA; Number of Channels: 单路; Operating Temperature: -55℃~+125℃; level of protection: IEC 61000-4-5；IEC 61000-4-2; Type: TVS; Junction Capacitance: 0.45pF
R29-R31 R37-R39 R72-R74 R76-R78 R80-R82 R84-R86 = FRC0603F1001TS: 电阻类型:厚膜电阻;阻值:1kΩ;精度:±1%;功率:100mW;工作电压:75V;温度系数:±100ppm/℃;; LCSC Part Name: 1kΩ ±1% 100mW 厚膜电阻; Supplier Part: C2907002; Manufacturer: FOJAN(富捷); Supplier Footprint: 0603; JLCPCB Part Class: Extended Part; Datasheet: https://item.szlcsc.com/datasheet/FRC0603F1001TS/3180515.html; Supplier: LCSC; Type: 厚膜电阻; Tolerance: ±1%; Power(Watts): 100mW; Voltage-Supply(Max): 75V; Temperature Coefficient: ±100ppm/℃; Operating Temperature: -55℃~+155℃
R1 R4 R5 R8 R9 R12 R14 R15 R18 R32 R40 R75 R79 R83 R87 = FRC0603F1003TS: 电阻类型:厚膜电阻;阻值:100kΩ;精度:±1%;功率:100mW;工作电压:75V;温度系数:±100ppm/℃;; LCSC Part Name: 100kΩ ±1% 100mW 厚膜电阻; Supplier Part: C2906980; Manufacturer: FOJAN(富捷); Supplier Footprint: 0603; JLCPCB Part Class: Extended Part; Datasheet: https://item.szlcsc.com/datasheet/FRC0603F1003TS/3180493.html; Supplier: LCSC; Type: 厚膜电阻; Tolerance: ±1%; Power(Watts): 100mW; Voltage-Supply(Max): 75V; Temperature Coefficient: ±100ppm/℃; Operating Temperature: -55℃~+155℃
U22 U24-U28 = XDWF-0125WT-03P: 插针结构:1x3P;间距:1.25mm;安装方式:卧贴;总PIN数:3P;排数:1;每排PIN数:3;额定电流:2A;触头材质:铜;触头镀层:锡;工作温度:-40℃~+85℃;; LCSC Part Name: 1x3P 间距:1.25mm 卧贴; Supplier Part: C7527564; Manufacturer: LX(连欣科技); Supplier Footprint: SMD,P=1.25mm,卧贴; JLCPCB Part Class: Extended Part; Datasheet: https://item.szlcsc.com/datasheet/XDWF-0125WT-03P/8623285.html; Supplier: LCSC; Pins Structure: 1x3P; Pitch: 1.25mm; Mounting Type: 卧贴; Number of Pins: 3P; Number of Rows: 1; Number of PINs Per Row: 3; Current Rating: 2A; Contact Material: 铜; Contact Plating: 锡; Operating Temperature: -40℃~+85℃; Voltage Rating: 100V; Plastic Material: LCP; Flame Retardant Rating: UL94V-0; Color: 白色; Z-Height of the Board: 3.5mm; Y-Width of Bottom Edge on Board: 4.3mm
C17 = CGA0603X7R104K500JT: 容值:100nF;精度:±10%;额定电压:50V;温度系数:X7R;; LCSC Part Name: 100nF ±10% 50V; Supplier Part: C6119867; Manufacturer: HRE(芯声); Supplier Footprint: 0603; JLCPCB Part Class: Extended Part; Datasheet: https://item.szlcsc.com/datasheet/CGA0603X7R104K500JT/7062573.html; Supplier: LCSC; Tolerance: ±10%; Voltage Rating: 50V; Temperature Coefficient: X7R
C53 C54 = 0603B105K500NT: 容值:1uF;精度:±10%;额定电压:50V;温度系数:X7R;; LCSC Part Name: 1uF ±10% 50V; Supplier Part: C90540; Manufacturer: FH(风华); Supplier Footprint: 0603; JLCPCB Part Class: Extended Part; Datasheet: https://item.szlcsc.com/datasheet/0603B105K500NT/91727.html; Supplier: LCSC; Tolerance: ±10%; Voltage Rating: 50V; Temperature Coefficient: X7R
D1 = SMBJ28A_C178227: 极性:单向;反向截止电压(Vrwm):28V;钳位电压:45.4V;峰值脉冲电流(Ipp):13.3A@10/1000us;峰值脉冲功率(Ppp):600W@10/1000us;击穿电压(VBR):34.4V;; LCSC Part Name: 单向TVS 28V截止 峰值浪涌电流：13.3A@10/1000us; Supplier Part: C178227; Manufacturer: Littelfuse(美国力特); Supplier Footprint: DO-214AA; JLCPCB Part Class: Extended Part; Datasheet: https://item.szlcsc.com/datasheet/SMBJ28A/189619.html; Supplier: LCSC; Polarity: 单向; Reverse Stand-Off Voltage (Vrwm): 28V; Clamping Voltage: 45.4V; Peak Pulse Current (Ipp): 13.3A@10/1000us; Peak Pulse Power Dissipation (Ppp): 600W@10/1000us; Voltage - Breakdown: 34.4V; Reverse Leakage Current (Ir): 1uA; Number of Channels: 单路; Operating Temperature: -65℃~+150℃; level of protection: IEC 61000-4-4；IEC 61000-4-2; Type: TVS
D2 D4 D6 D8 D10 = BZT52C12_C19077410: 二极管配置:1个独立式;稳压值(标称值):12V;稳压值(范围):11.4V~12.6V;耗散功率(Pd):350mW;; LCSC Part Name: 表面贴装齐纳二极管; Supplier Part: C19077410; Manufacturer: R+O(宏嘉诚); Supplier Footprint: SOD-123; JLCPCB Part Class: Extended Part; Datasheet: https://item.szlcsc.com/datasheet/BZT52C12/20275495.html; Supplier: LCSC; Diode Configuration: 1个独立式; Zener Voltage(Nom): 12V; Reverse Leakage Current (Ir): 100nA@8V; Zener Voltage(Range): 11.4V~12.6V; Pd - Power Dissipation: 350mW; Impedance(Zzt): 25Ω; Impedance(Zzk): 150Ω; Operating Junction Temperature Range: -55℃~+150℃
D3 D5 D7 D9 D11 = SMBJ28A_C353370: 反向截止电压(Vrwm):28V;钳位电压:45.4V;峰值脉冲电流(Ipp):13.3A@10/1000us;峰值脉冲功率(Ppp):600W@10/1000us;击穿电压(VBR):34.4V;; LCSC Part Name: TVS 28V截止 峰值浪涌电流：13.3A@10/1000us; Supplier Part: C353370; Manufacturer: 晶导微电子; Supplier Footprint: SMB; JLCPCB Part Class: Extended Part; Datasheet: https://item.szlcsc.com/datasheet/SMBJ28A/329119.html; Supplier: LCSC; Reverse Stand-Off Voltage (Vrwm): 28V; Clamping Voltage: 45.4V; Peak Pulse Current (Ipp): 13.3A@10/1000us; Peak Pulse Power Dissipation (Ppp): 600W@10/1000us; Voltage - Breakdown: 34.4V; Reverse Leakage Current (Ir): 1uA; Type: TVS; Junction Capacitance: 390pF
DC1 = DC-005-A200: 连接器类型:DC电源插座;安装方式:弯插;触点内径:2mm;触点外径:6.4mm;额定电流:3A;额定电压:30V;工作温度:-20℃~+70℃;; LCSC Part Name: DC电源插座 内径:2mm 外径:6.4mm; Supplier Part: C720557; Manufacturer: XUNPU(讯普); Supplier Footprint: 插件; JLCPCB Part Class: Extended Part; Datasheet: https://item.szlcsc.com/datasheet/DC-005-A200/763564.html; Supplier: LCSC; Connector Type: DC电源插座; Mounting Type: 弯插; Inside Contact Diameter: 2mm; Outside Contact Diameter: 6.4mm; Current Rating: 3A; Voltage Rating (Max): 30V; Operating Temperature: -20℃~+70℃
F1-F9 = AF2-6.30V125TM: 类型:贴片式保险丝;额定电流:6.3A;额定电压:125V;分断能力:50A;; LCSC Part Name: 125V贴片式保险丝; Supplier Part: C242472; Manufacturer: AEM; Supplier Footprint: 2410; JLCPCB Part Class: Extended Part; Datasheet: https://item.szlcsc.com/datasheet/AF2-6.30V125TM/241277.html; Supplier: LCSC; Type: 贴片式保险丝; Current Rating: 6.3A; Voltage Rating (DC): 125V; Operating Temperature: -55℃~+125℃; Melting I2t: 12.5; Interrupt Rating: 50A; Length: 6.1mm; Width: 2.5mm; Height: 2.2mm
Q1 Q4 Q6 Q8 = SQD50P06-15L_GE3: 数量:1个P沟道;漏源电压(Vdss):60V;连续漏极电流(Id):50A;导通电阻(RDS(on)):15.5mΩ@10V;耗散功率(Pd):136W;阈值电压(Vgs(th)):2.5V;; LCSC Part Name: 1个P沟道 耐压:60V 电流:50A; Supplier Part: C3281500; Manufacturer: VISHAY(威世); Supplier Footprint: TO-252; JLCPCB Part Class: Extended Part; Datasheet: https://item.szlcsc.com/datasheet/SQD50P06-15L_GE3/3844398.html; Supplier: LCSC; Number: 1个P沟道; Drain to Source Voltage: 60V; Current - Continuous Drain(Id): 50A; RDS(on): 15.5mΩ@10V; Pd - Power Dissipation: 136W; Gate Threshold Voltage (Vgs(th)): 2.5V; Gate Charge(Qg): 98nC@10V; Input Capacitance(Ciss): 5.91nF; Reverse Transfer Capacitance (Crss@Vds): 410pF; Operating Temperature: -55℃~+175℃; Type: P沟道; Output Capacitance(Coss): 606pF
Q2 = SQM120P06-07L_GE3: 数量:1个P沟道;漏源电压(Vdss):60V;连续漏极电流(Id):120A;导通电阻(RDS(on)):8.8mΩ@4.5V;耗散功率(Pd):375W;阈值电压(Vgs(th)):2.5V;; LCSC Part Name: 1个P沟道 耐压:60V 电流:120A; Supplier Part: C222447; Manufacturer: VISHAY(威世); Supplier Footprint: TO-263; JLCPCB Part Class: Extended Part; Datasheet: https://item.szlcsc.com/datasheet/SQM120P06-07L_GE3/222742.html; Supplier: LCSC; Number: 1个P沟道; Drain to Source Voltage: 60V; Current - Continuous Drain(Id): 120A; RDS(on): 8.8mΩ@4.5V; Pd - Power Dissipation: 375W; Gate Threshold Voltage (Vgs(th)): 2.5V; Gate Charge(Qg): 270nC@10V; Input Capacitance(Ciss): 14.28nF; Reverse Transfer Capacitance (Crss@Vds): 1.295nF; Operating Temperature: -55℃~+175℃; Type: P沟道; Output Capacitance(Coss): 1.034nF; Vgs: ±20V
Q3 Q5 Q7 Q9 = 2N7002_C7420321: 数量:1个N沟道;漏源电压(Vdss):60V;连续漏极电流(Id):115mA;导通电阻(RDS(on)):900mΩ@10V;耗散功率(Pd):225mW;阈值电压(Vgs(th)):1.6V;; LCSC Part Name: N沟道,电流:115mA,耐压:60V; Supplier Part: C7420321; Manufacturer: R+O(宏嘉诚); Supplier Footprint: SOT-23; JLCPCB Part Class: Extended Part; Datasheet: https://item.szlcsc.com/datasheet/2N7002/8397143.html; Supplier: LCSC; Number: 1个N沟道; Drain to Source Voltage: 60V; Current - Continuous Drain(Id): 115mA; RDS(on): 900mΩ@10V; Pd - Power Dissipation: 225mW; Gate Threshold Voltage (Vgs(th)): 1.6V; Gate Charge(Qg): 1.6nC@10V; Input Capacitance(Ciss): 50pF; Reverse Transfer Capacitance (Crss@Vds): 5pF; Operating Temperature: -55℃~+150℃; Type: N沟道; Output Capacitance(Coss): 25pF
R2 R6 R10 R13 R16 = 0603WAF1002T5E: 电阻类型:厚膜电阻;阻值:10kΩ;精度:±1%;功率:100mW;工作电压:75V;温度系数:±100ppm/℃;; LCSC Part Name: 厚膜电阻 10kΩ ±1% 100mW; Supplier Part: C25804; Manufacturer: UNI-ROYAL(厚声); Supplier Footprint: 0603; JLCPCB Part Class: Basic Part; Datasheet: https://item.szlcsc.com/datasheet/0603WAF1002T5E/26547.html; Supplier: LCSC; Type: 厚膜电阻; Tolerance: ±1%; Power(Watts): 100mW; Voltage-Supply(Max): 75V; Temperature Coefficient: ±100ppm/℃; Operating Temperature: -55℃~+155℃
R101 R102 = JER2512F2R010: 电阻类型:采样电阻;阻值:10mΩ;精度:±1%;功率:2W;温度系数:±50ppm/℃;; LCSC Part Name: 10mΩ 2W 2512 ±1%; Supplier Part: C49164691; Manufacturer: JIERR(捷而瑞); Supplier Footprint: 2512; JLCPCB Part Class: Extended Part; Datasheet: https://item.szlcsc.com/datasheet/JER2512F2R010/51553034.html; Supplier: LCSC; Type: 采样电阻; Tolerance: ±1%; Power(Watts): 2W; Temperature Coefficient: ±50ppm/℃
R103 = JER2512F2R005: 电阻类型:采样电阻;阻值:5mΩ;精度:±1%;功率:2W;温度系数:±50ppm/℃;安装方式:贴片;; LCSC Part Name: 5mΩ 2W 2512 ±1%; Supplier Part: C49164688; Manufacturer: JIERR(捷而瑞); Supplier Footprint: 2512; JLCPCB Part Class: Extended Part; Datasheet: https://item.szlcsc.com/datasheet/JER2512F2R005/51553031.html; Supplier: LCSC; Type: 采样电阻; Tolerance: ±1%; Power(Watts): 2W; Temperature Coefficient: ±50ppm/℃; Mounting Type: 贴片
TP11 TP13 TP14 TP18 = Test-Point: Test Point 测试点
U1 = SS-12D06-G050: 电路结构:单刀双掷;安装方式:弯插;开关颜色:黑色;额定电流:3A;额定电压:250V;工作寿命:1万次;; LCSC Part Name: SS-12D06 大电流拨动开关 G5.0柄; Supplier Part: C17179521; Manufacturer: G-Switch(品赞); Supplier Footprint: 弯插,12.7x6.6mm; JLCPCB Part Class: Extended Part; Datasheet: https://item.szlcsc.com/datasheet/SS-12D06-G050/18307143.html; Supplier: LCSC; Circuit: 单刀双掷; Actuator Style: 矩形柱状; Termination Style: PC引脚; Length: 12.7mm; Width: 6.6mm; Switch Height: 11.4mm; Mounting Type: 弯插; Actuator Color: 黑色; Current Rating: 3A; Voltage Rating: 250V; Life: 1万次; Operating Temperature: -40℃~+85℃
U2 = AF2-15.0V065TM: 类型:贴片式保险丝;额定电流:15A;额定电压:65V;分断能力:50A;; LCSC Part Name: 65V贴片式保险丝; Supplier Part: C311020; Manufacturer: AEM; Supplier Footprint: 2410; JLCPCB Part Class: Extended Part; Datasheet: https://item.szlcsc.com/datasheet/AF2-15.0V065TM/294346.html; Supplier: LCSC; Type: 贴片式保险丝; Current Rating: 15A; Voltage Rating (DC): 65V; Operating Temperature: -55℃~+125℃; Melting I2t: 102.5; Interrupt Rating: 50A; Length: 6.1mm; Width: 2.49mm; Height: 2.16mm
U11 U12 = 电源焊盘
U19 U21 = 24V转12V
U20 = 24V转5V
U23 = AP2112K-3.3TRG1: 输出极性:正极;工作电压:6V;输出电压:3.3V;输出电流:600mA;电源纹波抑制比(PSRR):65dB@(1kHz);输出类型:固定;; LCSC Part Name: 3.3V 600mA 6V; Supplier Part: C51118; Manufacturer: DIODES(美台); Supplier Footprint: SOT-25-5; JLCPCB Part Class: Extended Part; Datasheet: https://item.szlcsc.com/datasheet/AP2112K-3.3TRG1/52131.html; Supplier: LCSC; Output Configuration: 正极; Voltage - Supply: 6V; Output Voltage: 3.3V; Output Current: 600mA; Power Supply Rejection Ratio (PSRR): 65dB@(1kHz); Voltage Dropout: 250mV@(600mA); standby current: 55uA; Noise: 50uVrms; Features: 使能控制；短路保护；输出放电；过流保护；热关断; Operating Temperature: -40℃~+85℃@(Ta); Output Type: 固定; Number of Outputs: 1

## Nets
3V3_MCU: C5.1 C6.1 C7.1 C8.1 C9.1 C10.1 C54.2 L1.2 R19.2 R20.2 R23.1 R24.1 U7.11(VDD) U7.19(VDD) U7.28(VDD) U7.50(VDD) U7.75(VDD) U7.100(VDD) U10.4 U23.5(VOUT) U30.1 U33.4 U35.4 ; also on sheet 5
5V_SYS: C53.2 U20.3(VOUT+) U23.1(VIN) U23.3(EN) ; also on sheet 5
12V_LINUX: R101.2 TP13.1 ; also on sheet 5
12V_MOTOR: C1.1 C20.2 C23.2 C29.2 C31.2 C33.2 C35.2 C37.2 C39.2 D14.1 R102.2 TP18.1 U8.4(VCC) U9.4(VCC) U13.4(VCC) U14.4(VCC) U15.4(VCC) U16.4(VCC) U17.4(VCC) U18.4(VCC) ; also on sheet 5
24V_DOWN_LAMP: D5.1(C) F6.2 Q4.2(D) ; also on sheet 5
24V_LINUX_IN: D9.1(C) F7.2 Q6.2(D) U19.1(VIN+) ; also on sheet 5
24V_MOTOR_IN: D11.1(C) F8.2 Q8.2(D) U21.1(VIN+) ; also on sheet 5
24V_UP_LAMP: D3.1(C) F5.2 Q1.2(D) ; also on sheet 5
GND: C1.2 C3.1 C4.1 C5.2 C6.2 C7.2 C8.2 C9.2 C10.2 C11.1 C12.1 C13.1 C14.1 C15.2 C16.1 C17.1 C19.1 C20.1 C22.1 C23.1 C25.1 C29.1 C31.1 C33.1 C35.1 C37.1 C39.1 C42.1 C44.1 C46.1 C48.1 C53.1 C54.1 CN1.3 CN1.4 CN2.3 CN2.4 CN3.3 CN3.4 CN4.3 CN4.4 CN9.3 CN9.4 CN10.3 CN10.4 CN11.3 CN11.4 CN12.3 CN12.4 D1.2(A) D3.2(A) D5.2(A) D7.2(A) D9.2(A) D11.2(A) D12.1(K1) D13.1(K1) D14.2 D15.1(K1) D16.1(K1) D17.1(K1) D18.1(K1) D21.2(A) D22.2(A) D23.2(A) D24.2(A) D25.2(A) D26.2(A) DC1.2 DC1.3 Q3.2(S) Q5.2(S) Q7.2(S) Q9.2(S) R4.2 R8.2 R14.2 R18.2 R21.1 R22.1 R26.2 R28.2 R30.1 R32.1 R34.2 R36.2 R38.1 R40.1 R49.2 R51.2 R53.2 R55.2 R57.2 R59.2 R61.2 R63.2 R65.2 R67.2 R69.2 R71.2 R73.1 R75.1 R77.1 R79.1 R81.1 R83.1 R85.1 R87.1 RST1.2 U1.3 U7.10(VSS) U7.20(VSSA) U7.27(VSS) U7.74(VSS) U7.99(VSS) U8.3(GND) U9.3(GND) U10.3 U10.5 U10.6 U13.3(GND) U14.3(GND) U15.3(GND) U16.3(GND) U17.3(GND) U18.3(GND) U19.2(VIN-) U19.4(VOUT-) U20.2(VIN-) U20.4(VOUT-) U21.2(VIN-) U21.4(VOUT-) U22.4 U22.5 U23.2(GND) U24.4 U24.5 U25.4 U25.5 U26.4 U26.5 U27.4 U27.5 U28.4 U28.5 U30.2 U30.5 U30.6 U33.3 U35.3 X2.2(GND) X2.4(GND) ; also on sheet 5
VBAT: R24.2 U7.6(VBAT)
VDDA: C11.2 C12.2 D12.2(K2) D13.2(K2) D15.2(K2) D16.2(K2) D17.2(K2) D18.2(K2) L1.1 R29.2 R37.2 R72.2 R76.2 R80.2 R84.2 U7.21(VREF+) U7.22(VDDA)
VIN_24_FUSED: C17.2 D1.1(C) D6.1(K) Q2.3(S) R12.1 U2.2 ; also on sheet 5
VIN_24_RAW: DC1.1 U2.1 ; also on sheet 5
VIN_24_SW: D7.1(C) F1.1 F2.1 F3.1 F4.1 F5.1 F6.1 F7.1 F8.1 F9.1 R103.2 ; also on sheet 5
BOOT0: BOOT1.1(A1) R22.2 U7.94(BOOT0)
BOOT1: BOOT1.2(A2) R21.2 U7.37(PB2)
BUZZER: U7.31(PA6) ; also on sheet 5
DBG_UART_RX: U7.48(PB11) U30.3 U33.2
DBG_UART_TX: U7.47(PB10) U30.4 U33.1
DOWN_LAMP_PWR_EN: R7.1
DOWN_PWM1: U7.35(PB0) ; also on sheet 5
DOWN_PWM2: U7.36(PB1) ; also on sheet 5
DOWN_PWM3: U7.90(PB4) ; also on sheet 5
HOME_KEY: U7.46(PE15) ; also on sheet 5
LED_ACT: U7.32(PA7) ; also on sheet 5
LED_COMM: U7.30(PA5) ; also on sheet 5
LED_ERR: U7.38(PE7) ; also on sheet 5
LED_STATE: U7.29(PA4) ; also on sheet 5
LINUX_PWR_EN: R11.1
LINUX_PWR_PULSE: U7.51(PB12) ; also on sheet 5
LINUX_UART_RX: U7.69(PA10) ; also on sheet 5
LINUX_UART_TX: U7.68(PA9) ; also on sheet 5
M1_BI_PWM: R25.1 U7.26(PA3)
M1_FI_PWM: R27.1 U7.25(PA2)
M2_BI_PWM: R35.1 U7.24(PA1)
M2_FI_PWM: R33.1 U7.23(PA0)
M3_BI_PWM: R56.1 U7.5(PE6)
M3_FI_PWM: R58.1 U7.4(PE5)
M4_BI_PWM: R50.1 U7.54(PB15)
M4_FI_PWM: R48.1 U7.53(PB14)
M5_BI_PWM: R54.1 U7.64(PC7)
M5_FI_PWM: R52.1 U7.63(PC6)
M6_BI_PWM: R62.1 U7.65(PC8)
M6_FI_PWM: R60.1 U7.66(PC9)
M7_BI_PWM: R66.1 U7.93(PB7)
M7_FI_PWM: R64.1 U7.92(PB6)
M8_BI_PWM: R70.1 U7.96(PB9)
M8_FI_PWM: R68.1 U7.95(PB8)
MOTOR_PWR_EN: R17.1
NRST: C15.1 R23.2 RST1.1 U7.14(NRST)
OS_8M_IN: C19.2 U7.12(PH0) X2.1
OS_8M_OUT: C16.2 U7.13(PH1) X2.3
OS_32K_IN: C3.2 U7.8(PC14) X1.1(OSC1)
OS_32K_OUT: C4.2 U7.9(PC15) X1.2(OSC2)
PA8: U7.67(PA8)
PA11: U7.70(PA11)
PA12: U7.71(PA12)
PA13: U7.72(PA13) U10.1 U35.1
PA14: U7.76(PA14) U10.2 U35.2
PA15: U7.77(PA15)
PB3: U7.89(PB3)
PB5: U7.91(PB5)
PB13: U7.52(PB13)
PC0: C42.2 D15.3(A) R74.1 R75.2 U7.15(PC0) ; also on sheet 5
PC1: C25.2 D12.3(A) R39.1 R40.2 U7.16(PC1) ; also on sheet 5
PC2: C22.2 D13.3(A) R31.1 R32.2 U7.17(PC2) ; also on sheet 5
PC3: C44.2 D17.3(A) R78.1 R79.2 U7.18(PC3) ; also on sheet 5
PC4: C46.2 D16.3(A) R82.1 R83.2 U7.33(PC4) ; also on sheet 5
PC5: C48.2 D18.3(A) R86.1 R87.2 U7.34(PC5) ; also on sheet 5
PC10: U7.78(PC10)
PC11: U7.79(PC11)
PC12: U7.80(PC12)
PC13: U7.7(PC13)
PD0: U7.81(PD0)
PD1: U7.82(PD1)
PD2: U7.83(PD2)
PD3: U7.84(PD3)
PD4: U7.85(PD4)
PD5: U7.86(PD5)
PD6: U7.87(PD6)
PD7: U7.88(PD7)
PD8: U7.55(PD8)
PD9: U7.56(PD9)
PD10: U7.57(PD10)
PD11: U7.58(PD11)
PD12: U7.59(PD12)
PD13: U7.60(PD13)
PD14: U7.61(PD14)
PD15: U7.62(PD15)
PE0: U7.97(PE0)
PE1: U7.98(PE1)
PE2: U7.1(PE2)
PE3: U7.2(PE3)
PE4: U7.3(PE4)
PE8: U7.39(PE8)
PE9: U7.40(PE9) ; also on sheet 5
PE10: U7.41(PE10)
PE11: U7.42(PE11) ; also on sheet 5
PE12: U7.43(PE12)
PE13: U7.44(PE13) ; also on sheet 5
PE14: U7.45(PE14) ; also on sheet 5
POT1_DOWN: C21.1 R30.2 U22.3
POT1_MID: D22.1(K) R31.2 U22.2
POT1_UP: C21.2 R29.1 U22.1
POT2_DOWN: C24.1 R38.2 U24.3
POT2_MID: D21.1(K) R39.2 U24.2
POT2_UP: C24.2 R37.1 U24.1
POT3_DOWN: C41.1 R73.2 U25.3
POT3_MID: D23.1(K) R74.2 U25.2
POT3_UP: C41.2 R72.1 U25.1
POT4_DOWN: C43.1 R77.2 U26.3
POT4_MID: D26.1(K) R78.2 U26.2
POT4_UP: C43.2 R76.1 U26.1
POT5_DOWN: C45.1 R81.2 U27.3
POT5_MID: D25.1(K) R82.2 U27.2
POT5_UP: C45.2 R80.1 U27.1
POT6_DOWN: C47.1 R85.2 U28.3
POT6_MID: D24.1(K) R86.2 U28.2
POT6_UP: C47.2 R84.1 U28.1
UP_LAMP_PWR_EN: R3.1
VCAP_1: C13.2 U7.49(VCAP_1)
VCAP_2: C14.2 U7.73(VCAP_2)
$1N14: R13.2 U1.2
$1N16: D6.2(A) Q2.1(G) R12.2 R13.1
$1N96: F9.2 U20.1(VIN+)
$1N98: R101.1 TP11.1 U19.3(VOUT+)
$1N101: R102.1 TP14.1 U21.3(VOUT+)
$1N102: Q2.4(D) R103.1
$3N114: BOOT1.3(B2) R19.1
$3N115: BOOT1.4(B1) R20.1
$4N7: R27.2 R28.1 U8.2(FI)
$4N11: R25.2 R26.1 U8.1(BI)
$4N12: C26.2 CN9.2 U8.7(BO) U8.8(BO)
$4N13: C26.1 CN9.1 U8.5(FO) U8.6(FO)
$4N29: C28.2 CN2.1 U9.5(FO) U9.6(FO)
$4N30: C28.1 CN2.2 U9.7(BO) U9.8(BO)
$4N31: R35.2 R36.1 U9.1(BI)
$4N32: R33.2 R34.1 U9.2(FI)
$4N40: C30.1 CN10.1 U13.5(FO) U13.6(FO)
$4N41: C30.2 CN10.2 U13.7(BO) U13.8(BO)
$4N42: R50.2 R51.1 U13.1(BI)
$4N43: R48.2 R49.1 U13.2(FI)
$4N51: C32.1 CN11.1 U14.5(FO) U14.6(FO)
$4N52: C32.2 CN11.2 U14.7(BO) U14.8(BO)
$4N53: R54.2 R55.1 U14.1(BI)
$4N54: R52.2 R53.1 U14.2(FI)
$4N63: C34.1 CN3.1 U15.5(FO) U15.6(FO)
$4N64: C36.1 CN1.1 U16.5(FO) U16.6(FO)
$4N65: C36.2 CN1.2 U16.7(BO) U16.8(BO)
$4N66: C34.2 CN3.2 U15.7(BO) U15.8(BO)
$4N67: R56.2 R57.1 U15.1(BI)
$4N68: R62.2 R63.1 U16.1(BI)
$4N69: R58.2 R59.1 U15.2(FI)
$4N70: R60.2 R61.1 U16.2(FI)
$4N85: C38.1 CN4.1 U17.5(FO) U17.6(FO)
$4N86: C40.1 CN12.1 U18.5(FO) U18.6(FO)
$4N87: C40.2 CN12.2 U18.7(BO) U18.8(BO)
$4N88: C38.2 CN4.2 U17.7(BO) U17.8(BO)
$4N89: R66.2 R67.1 U17.1(BI)
$4N90: R70.2 R71.1 U18.1(BI)
$4N91: R64.2 R65.1 U17.2(FI)
$4N92: R68.2 R69.1 U18.2(FI)
Net-(D2-1): D2.1(K) F1.2 Q1.3(S) R1.1
Net-(D2-2): D2.2(A) Q1.1(G) R1.2 R2.1
Net-(D4-1): D4.1(K) F2.2 Q4.3(S) R5.1
Net-(D4-2): D4.2(A) Q4.1(G) R5.2 R6.1
Net-(D8-1): D8.1(K) F3.2 Q6.3(S) R9.1
Net-(D8-2): D8.2(A) Q6.1(G) R9.2 R10.1
Net-(D10-1): D10.1(K) F4.2 Q8.3(S) R15.1
Net-(D10-2): D10.2(A) Q8.1(G) R15.2 R16.1
Net-(Q3-1): Q3.1(G) R3.2 R4.1
Net-(Q3-3): Q3.3(D) R2.2
Net-(Q5-1): Q5.1(G) R7.2 R8.1
Net-(Q5-3): Q5.3(D) R6.2
Net-(Q7-1): Q7.1(G) R11.2 R14.1
Net-(Q7-3): Q7.3(D) R10.2
Net-(Q9-1): Q9.1(G) R17.2 R18.1
Net-(Q9-3): Q9.3(D) R16.2

Not connected (* = marked no-connect by the designer): TP1 1*; TP2 1*; TP3 1*; TP4 1*; U1 1*; U11 1; U12 1; U23 4(NC)*

## Notes on the sheets
sheet 1
- 24V输入
- 上灯板电源控制
- 24V输入总开关
- 5V降压
- LINUX电源控制
- 电机电源控制
- 12V
  LINUX
  降压
- 12V
  电机
  降压
- 下灯板电源控制
- 5V转
  3V3
sheet 2
- 滤波电容
- 晶振电路
- 模拟电压
- BOOT模式
- 复位电路
- SWD接口
sheet 3
- 电机1驱动
- 电机2驱动
- 电机3驱动
- 电机4驱动
- 电机5驱动
- 电机6驱动
- 12V母线
- 电机7驱动
- 电机8驱动
sheet 4
- 电机1反馈
- 电机2反馈
- 电机3反馈
- 电机4反馈
- 电机5反馈
- 电机6反馈
